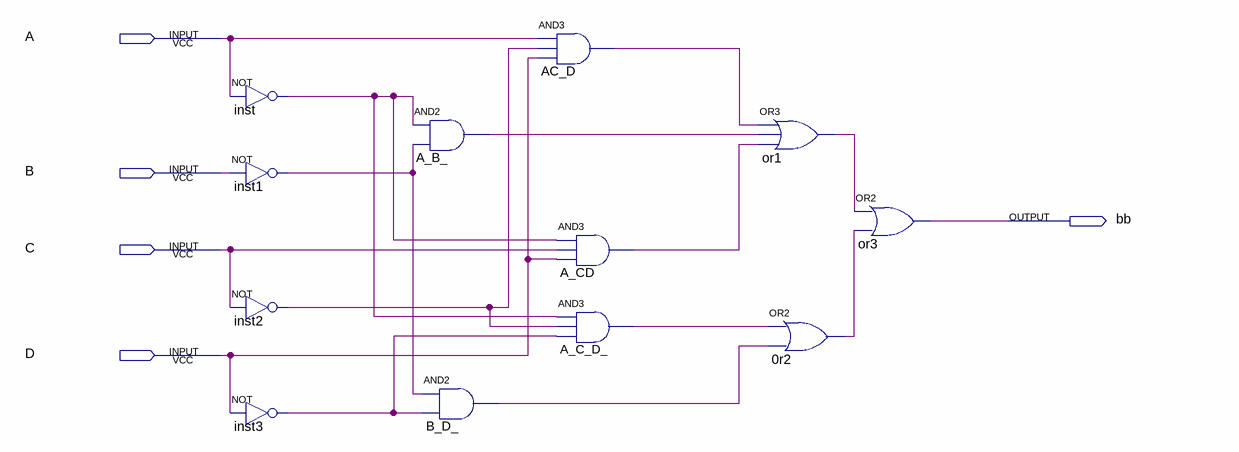
[diagram p0: schematic sheet]
// Quartus schematic output_b.bdf as structural Verilog: 12 symbols, 5 pins
module output_b (
  input  A,
  input  B,
  input  C,
  input  D,
  output bb
);

  wire A_B__out, A_C_D__out, A_CD_out, AC_D_out, B_D__out, inst1_out, inst2_out, inst3_out, inst_out,
       n0r2_out, or1_out;

  not inst (inst_out, A);
  not inst1 (inst1_out, B);
  not inst2 (inst2_out, C);
  not inst3 (inst3_out, D);
  and A_B_ (A_B__out, inst_out, inst1_out);
  and B_D_ (B_D__out, inst1_out, inst3_out);
  and AC_D (AC_D_out, A, inst2_out, D);
  and A_CD (A_CD_out, inst_out, C, D);
  and A_C_D_ (A_C_D__out, inst_out, inst2_out, inst3_out);
  or or1 (or1_out, AC_D_out, A_B__out, A_CD_out);
  or u_0r2 (n0r2_out, A_C_D__out, B_D__out);
  or or3 (bb, or1_out, n0r2_out);
endmodule
